# EAGLE schematic Schematics (EAGLE 8.5.0)
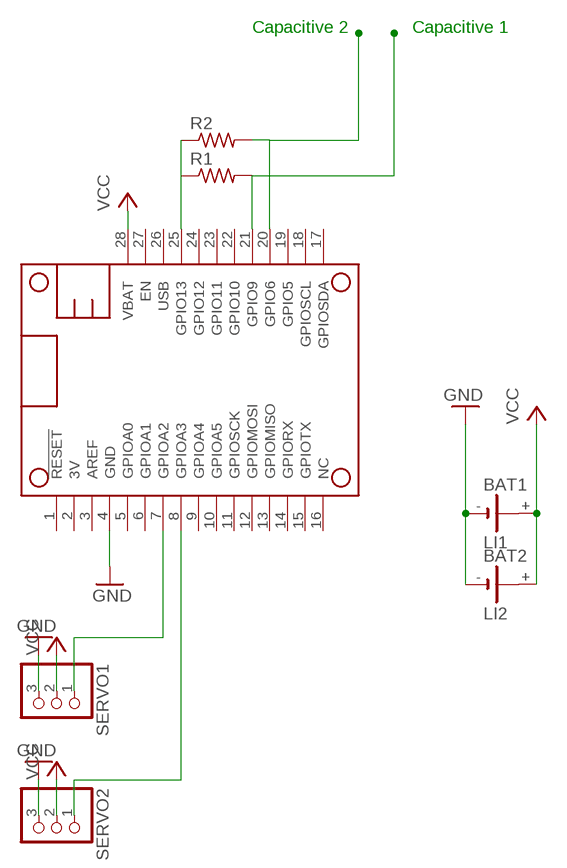
[diagram p0: schematic, sheet 1]

## Parts
BAT1  LI1  CR1/2  [CR1/2]
BAT2  LI2  CR1/2  [CR1/2]
MS1  FEATHERWING  [FEATHERWING]
R1  R-US_0411/12  [0411/12]
R2  R-US_0411/12  [0411/12]
SERVO1  PINHD-1X3  [1X03]
SERVO2  PINHD-1X3  [1X03]

## Nets
GND: BAT1.- BAT2.- MS1.4(GND) SERVO1.3 SERVO2.3
N$1: MS1.25(GPIO13) R2.1
N$2: MS1.7(GPIOA2) SERVO1.1
N$3: MS1.21(GPIO9) R1.2
N$4: MS1.8(GPIOA3) SERVO2.1
N$5: MS1.20(GPIO6) R2.2
VCC: BAT1.+ BAT2.+ MS1.28(VBAT) SERVO1.2 SERVO2.2
Unconnected: BAT1.+@1(+) BAT2.+@1(+) MS1.1(!RESET) MS1.2(3V) MS1.3(AREF) MS1.5(GPIOA0) MS1.6(GPIOA1) MS1.9(GPIOA4) MS1.10(GPIOA5) MS1.11(GPIOSCK) MS1.12(GPIOMOSI) MS1.13(GPIOMISO) MS1.14(GPIORX) MS1.15(GPIOTX) MS1.16(NC) MS1.17(GPIOSDA) MS1.18(GPIOSCL) MS1.19(GPIO5) MS1.22(GPIO10) MS1.23(GPIO11) MS1.24(GPIO12) MS1.26(USB) MS1.27(EN) R1.1

## Notes on the sheet
- Capacitive 2 | Capacitive 1

## Library data of the parts
BAT1 BAT2 = battery:CR1/2: LI BATTERY Sonnenschein SL-350 PT
MS1 = adafruit:FEATHERWING
R1 R2 = adafruit:R-US_: RESISTOR, American symbol
SERVO1 SERVO2 = adafruit:PINHD-1X3: PIN HEADER